# Altium schematic sheet TOP.SchDoc: =DocumentName
size 420 x 297 mm; Organization: Queen's Formula SAE; Address1: 130 Stuart St, Kingston; Address2: Ontario; Address3: Canada; Address4: K7L 2V9; DocumentNumber: 1; Revision: 0; SheetNumber: 1; SheetTotal: 1
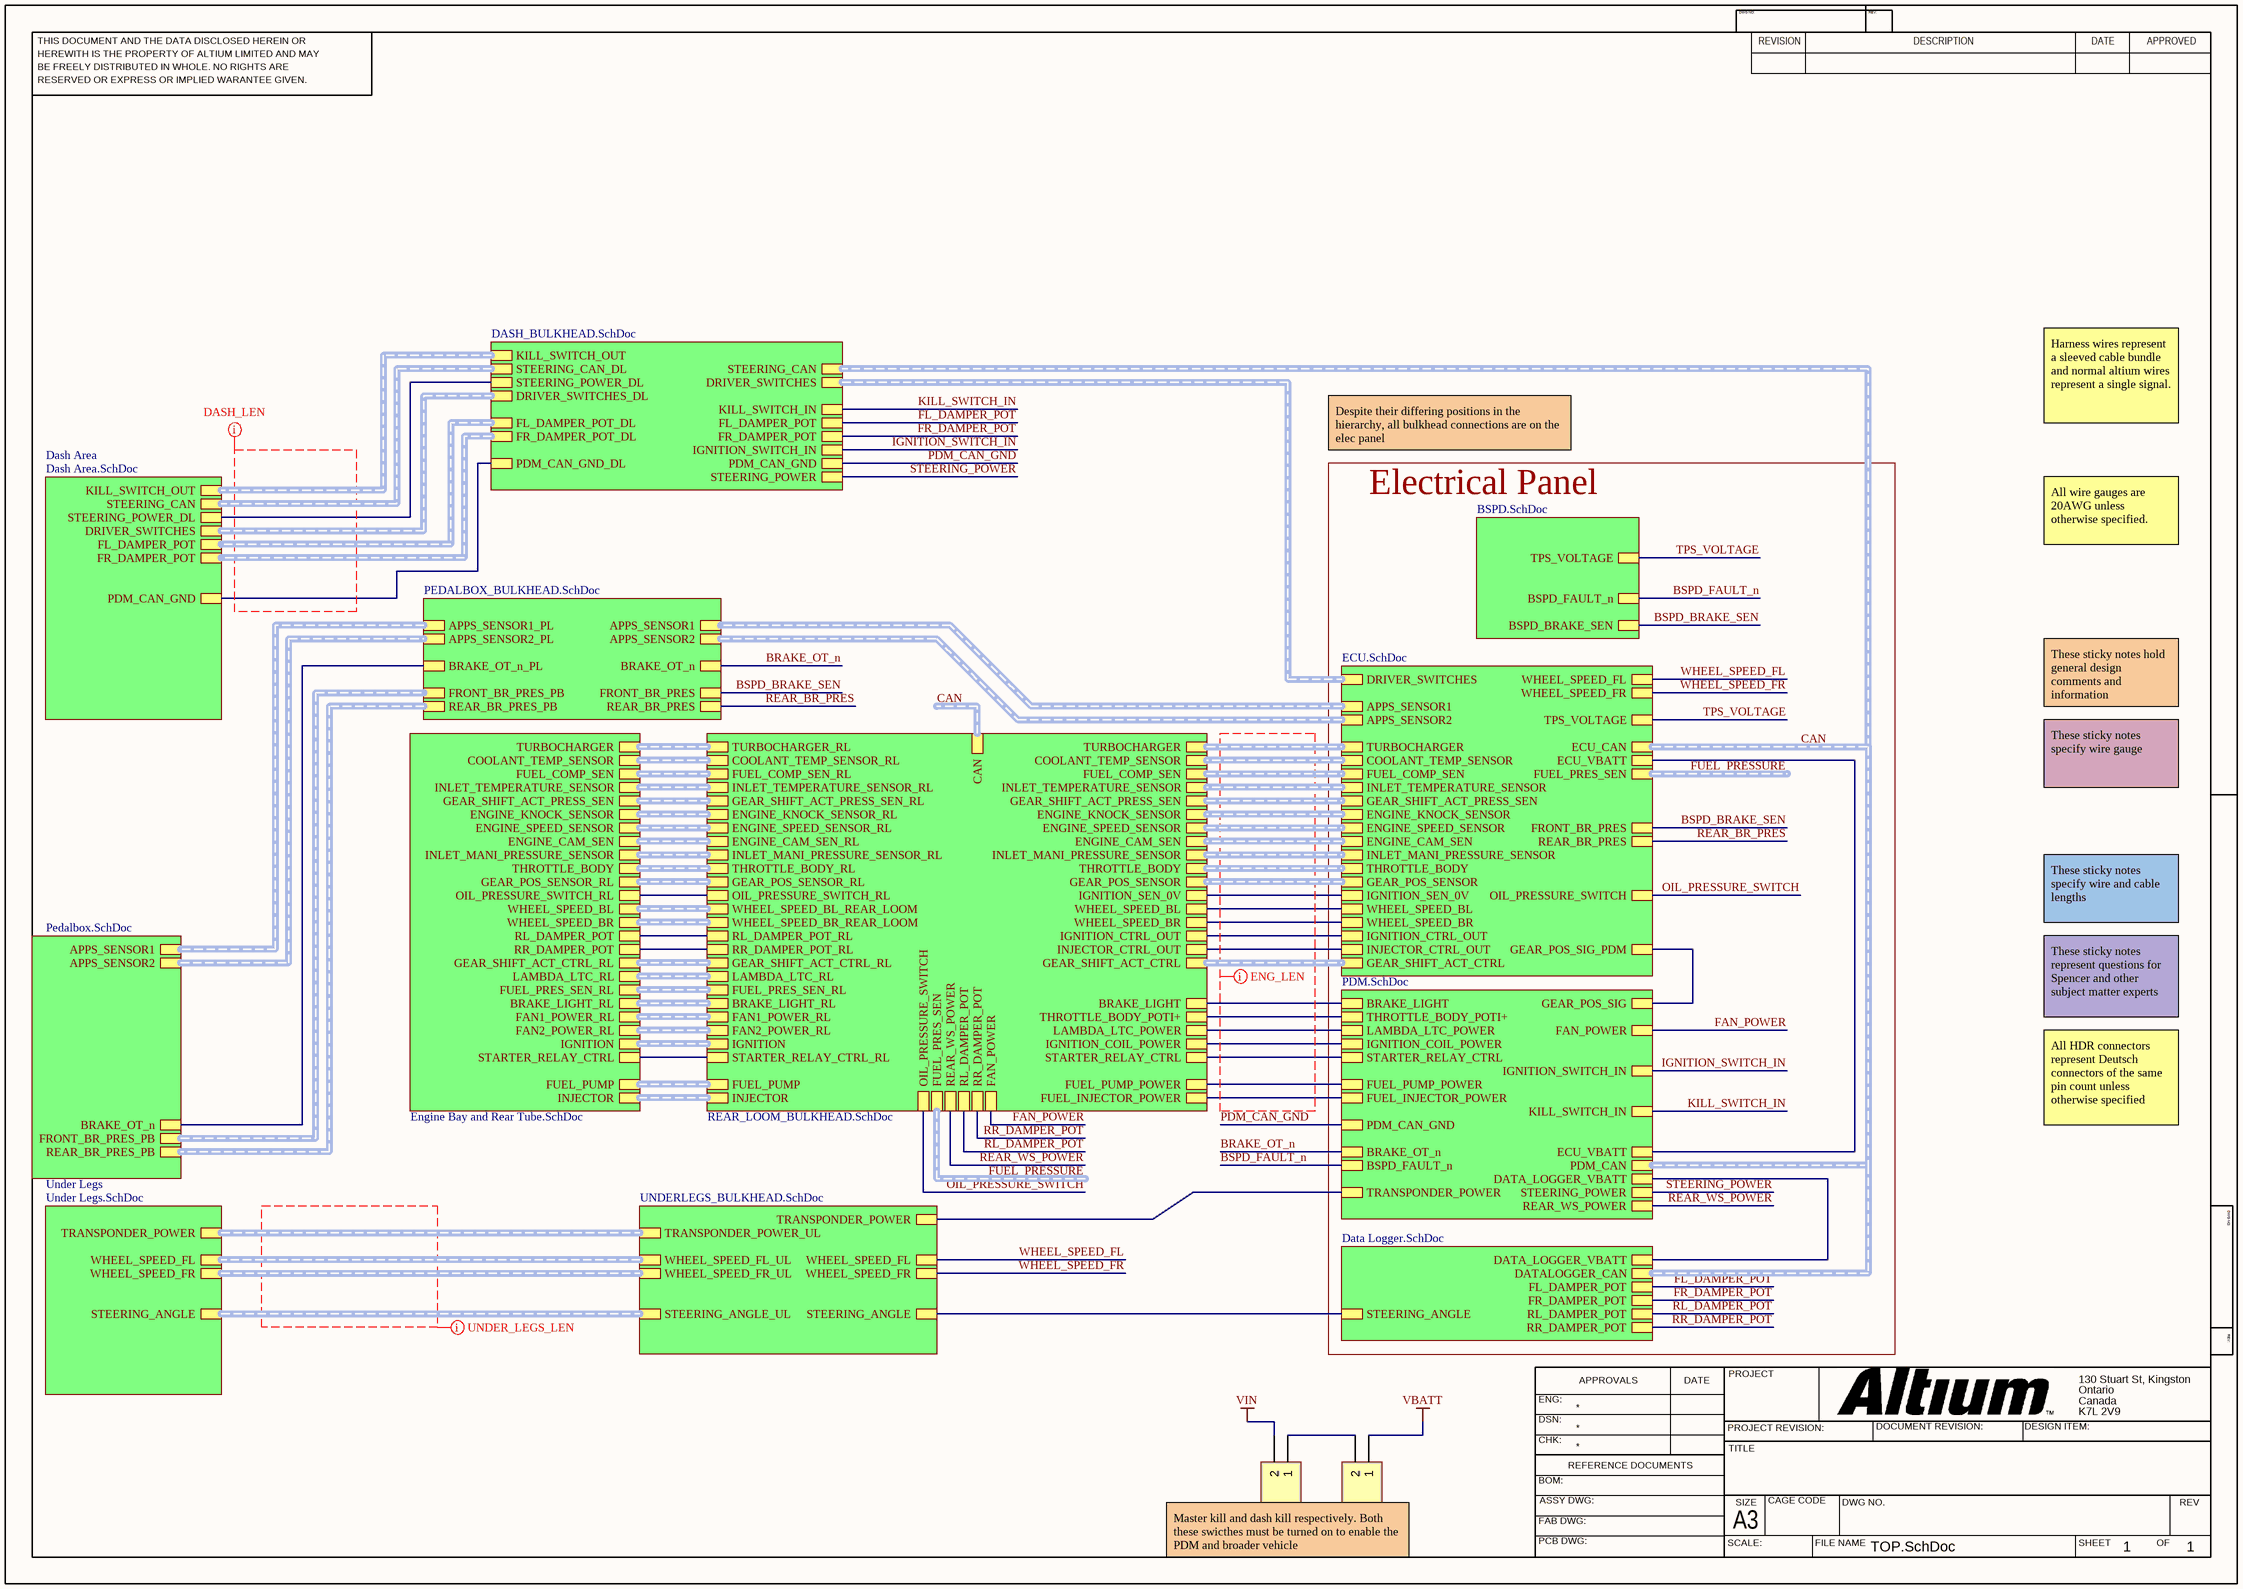
[diagram p0: TOP.SchDoc]

## Parts
(Parts that share a designator on the sheet are numbered #1, #2 ... from top to bottom, then left to right.)
ECU_CAN_CONNECTOR?#1  Header 2  [HDR1X2]  (value not drawn)
ECU_CAN_CONNECTOR?#2  Header 2  [HDR1X2]  (value not drawn)

## Sub-sheets
BSPD = BSPD.SchDoc: TPS_VOLTAGE, BSPD_BRAKE_SEN, BSPD_FAULT_n
Dash Area = Dash Area.SchDoc: STEERING_CAN (harness CAN), DRIVER_SWITCHES (harness DRIVER_SWITCHES), FL_DAMPER_POT, FR_DAMPER_POT, PDM_CAN_GND, STEERING_POWER_DL, KILL_SWITCH_OUT
DASH_BULKHEAD = DASH_BULKHEAD.SchDoc: DRIVER_SWITCHES (harness DRIVER_SWITCHES), STEERING_CAN (harness CAN), FL_DAMPER_POT, FR_DAMPER_POT, PDM_CAN_GND, DRIVER_SWITCHES_DL (harness DRIVER_SWITCHES), STEERING_CAN_DL (harness CAN), FL_DAMPER_POT_DL, FR_DAMPER_POT_DL, PDM_CAN_GND_DL, STEERING_POWER, STEERING_POWER_DL, KILL_SWITCH_IN, KILL_SWITCH_OUT, IGNITION_SWITCH_IN
Data Logger = Data Logger.SchDoc: DATALOGGER_CAN (harness CAN), DATA_LOGGER_VBATT, STEERING_ANGLE, RL_DAMPER_POT, RR_DAMPER_POT, FL_DAMPER_POT, FR_DAMPER_POT
ECU = ECU.SchDoc: ECU_CAN (harness CAN), ECU_VBATT, DRIVER_SWITCHES (harness DRIVER_SWITCHES), APPS_SENSOR1 (harness 3WIRE_PSG_SENSOR), COOLANT_TEMP_SENSOR (harness 2WIRE_SENSOR), INLET_TEMPERATURE_SENSOR (harness 2WIRE_SENSOR), FUEL_COMP_SEN (harness 2WIRE_SENSOR), GEAR_SHIFT_ACT_PRESS_SEN (harness 2WIRE_SENSOR), ENGINE_KNOCK_SENSOR (harness 2WIRE_ACTUATOR), ENGINE_SPEED_SENSOR (harness 2WIRE_ACTUATOR), WHEEL_SPEED_BL, WHEEL_SPEED_BR, WHEEL_SPEED_FL, WHEEL_SPEED_FR, ENGINE_CAM_SEN (harness 2WIRE_ACTUATOR), INLET_MANI_PRESSURE_SENSOR (harness 2WIRE_ACTUATOR), THROTTLE_BODY (harness 2WIRE_ACTUATOR), GEAR_SHIFT_ACT_CTRL (harness GEAR_SHIFT_ACTUATOR), TURBOCHARGER (harness TURBO), APPS_SENSOR2 (harness 3WIRE_PSG_SENSOR), IGNITION_CTRL_OUT, INJECTOR_CTRL_OUT, TPS_VOLTAGE, GEAR_POS_SENSOR (harness 2WIRE_ACTUATOR), IGNITION_SEN_0V, FUEL_PRES_SEN (harness 3WIRE_PSG_SENSOR), OIL_PRESSURE_SWITCH, FRONT_BR_PRES, REAR_BR_PRES, GEAR_POS_SIG_PDM
Engine Bay and Rear Tube = Engine Bay and Rear Tube.SchDoc: COOLANT_TEMP_SENSOR (harness 2WIRE_SENSOR), INLET_TEMPERATURE_SENSOR (harness 2WIRE_SENSOR), FUEL_COMP_SEN (harness 3WIRE_PSG_SENSOR), GEAR_SHIFT_ACT_PRESS_SEN (harness 3WIRE_PSG_SENSOR), ENGINE_KNOCK_SENSOR (harness 2WIRE_ACTUATOR), ENGINE_SPEED_SENSOR, ENGINE_CAM_SEN, INLET_MANI_PRESSURE_SENSOR, THROTTLE_BODY, WHEEL_SPEED_BL, WHEEL_SPEED_BR, GEAR_SHIFT_ACT_CTRL_RL, BRAKE_LIGHT_RL, IGNITION, STARTER_RELAY_CTRL, FUEL_PUMP, INJECTOR, TURBOCHARGER, RL_DAMPER_POT, RR_DAMPER_POT, GEAR_POS_SENSOR_RL, FAN1_POWER_RL, FAN2_POWER_RL, FUEL_PRES_SEN_RL, LAMBDA_LTC_RL, OIL_PRESSURE_SWITCH_RL
Engine Bay and Rear Tube = REAR_LOOM_BULKHEAD.SchDoc: BRAKE_LIGHT, WHEEL_SPEED_BL, WHEEL_SPEED_BR, THROTTLE_BODY_POTI+, IGNITION_COIL_POWER, STARTER_RELAY_CTRL, FUEL_PUMP_POWER, FUEL_INJECTOR_POWER, GEAR_SHIFT_ACT_CTRL, COOLANT_TEMP_SENSOR_RL (harness 2WIRE_SENSOR), INLET_TEMPERATURE_SENSOR_RL (harness 2WIRE_SENSOR), FUEL_COMP_SEN_RL (harness 3WIRE_PSG_SENSOR), GEAR_SHIFT_ACT_PRESS_SEN_RL (harness 3WIRE_PSG_SENSOR), ENGINE_KNOCK_SENSOR_RL (harness 2WIRE_ACTUATOR), ENGINE_SPEED_SENSOR_RL, ENGINE_CAM_SEN_RL, INLET_MANI_PRESSURE_SENSOR_RL, THROTTLE_BODY_RL, TURBOCHARGER_RL, COOLANT_TEMP_SENSOR (harness 2WIRE_SENSOR), INLET_TEMPERATURE_SENSOR (harness 2WIRE_SENSOR), FUEL_COMP_SEN (harness 3WIRE_PSG_SENSOR), GEAR_SHIFT_ACT_PRESS_SEN (harness 3WIRE_PSG_SENSOR), ENGINE_KNOCK_SENSOR (harness 2WIRE_ACTUATOR), ENGINE_SPEED_SENSOR, ENGINE_CAM_SEN, INLET_MANI_PRESSURE_SENSOR, THROTTLE_BODY, TURBOCHARGER, WHEEL_SPEED_BL_REAR_LOOM, WHEEL_SPEED_BR_REAR_LOOM, GEAR_SHIFT_ACT_CTRL_RL, BRAKE_LIGHT_RL, IGNITION_CTRL_OUT, INJECTOR_CTRL_OUT, IGNITION, INJECTOR, FUEL_PUMP, STARTER_RELAY_CTRL_RL, GEAR_POS_SENSOR, RL_DAMPER_POT_RL, RR_DAMPER_POT_RL, GEAR_POS_SENSOR_RL, RL_DAMPER_POT, RR_DAMPER_POT, REAR_WS_POWER, IGNITION_SEN_0V, FAN_POWER, FAN2_POWER_RL, FAN1_POWER_RL, FUEL_PRES_SEN_RL, FUEL_PRES_SEN, CAN, LAMBDA_LTC_POWER, LAMBDA_LTC_RL, OIL_PRESSURE_SWITCH, OIL_PRESSURE_SWITCH_RL
PDM = PDM.SchDoc: TRANSPONDER_POWER, BRAKE_LIGHT, BRAKE_OT_n, BSPD_FAULT_n, PDM_CAN_GND, PDM_CAN (harness CAN), DATA_LOGGER_VBATT, ECU_VBATT, KILL_SWITCH_IN, THROTTLE_BODY_POTI+, IGNITION_COIL_POWER, STARTER_RELAY_CTRL, FUEL_PUMP_POWER, FUEL_INJECTOR_POWER, FAN_POWER, STEERING_POWER, REAR_WS_POWER, LAMBDA_LTC_POWER, IGNITION_SWITCH_IN, GEAR_POS_SIG
Pedalbox = Pedalbox.SchDoc: APPS_SENSOR1 (harness 3WIRE_PSG_SENSOR), BRAKE_OT_n, APPS_SENSOR2, FRONT_BR_PRES_PB, REAR_BR_PRES_PB
PEDALBOX_BULKHEAD = PEDALBOX_BULKHEAD.SchDoc: APPS_SENSOR1 (harness 3WIRE_PSG_SENSOR), APPS_SENSOR2, BRAKE_OT_n, APPS_SENSOR1_PL (harness 3WIRE_PSG_SENSOR), APPS_SENSOR2_PL, BRAKE_OT_n_PL, REAR_BR_PRES, FRONT_BR_PRES, REAR_BR_PRES_PB, FRONT_BR_PRES_PB
Under Legs = Under Legs.SchDoc: STEERING_ANGLE, WHEEL_SPEED_FL, WHEEL_SPEED_FR, TRANSPONDER_POWER
UNDERLEGS_BULKHEAD = UNDERLEGS_BULKHEAD.SchDoc: STEERING_ANGLE, STEERING_ANGLE_UL, WHEEL_SPEED_FL, WHEEL_SPEED_FR, WHEEL_SPEED_FL_UL, WHEEL_SPEED_FR_UL, TRANSPONDER_POWER_UL, TRANSPONDER_POWER

## Nets
VBATT: ECU_CAN_CONNECTOR?#2.1
VIN: ECU_CAN_CONNECTOR?#1.2
BRAKE_OT_n: sheet PDM/BRAKE_OT_n, sheet PEDALBOX_BULKHEAD/BRAKE_OT_n
BSPD_BRAKE_SEN: sheet ECU/FRONT_BR_PRES, sheet PEDALBOX_BULKHEAD/FRONT_BR_PRES, sheet BSPD/BSPD_BRAKE_SEN
BSPD_FAULT_n: sheet PDM/BSPD_FAULT_n, sheet BSPD/BSPD_FAULT_n
FAN_POWER: sheet PDM/FAN_POWER, sheet Engine Bay and Rear Tube/FAN_POWER
FL_DAMPER_POT: sheet Data Logger/FL_DAMPER_POT, sheet DASH_BULKHEAD/FL_DAMPER_POT
FR_DAMPER_POT: sheet Data Logger/FR_DAMPER_POT, sheet DASH_BULKHEAD/FR_DAMPER_POT
IGNITION_SWITCH_IN: sheet PDM/IGNITION_SWITCH_IN, sheet DASH_BULKHEAD/IGNITION_SWITCH_IN
KILL_SWITCH_IN: sheet PDM/KILL_SWITCH_IN, sheet DASH_BULKHEAD/KILL_SWITCH_IN
OIL_PRESSURE_SWITCH: sheet ECU/OIL_PRESSURE_SWITCH, sheet Engine Bay and Rear Tube/OIL_PRESSURE_SWITCH
PDM_CAN_GND: sheet PDM/PDM_CAN_GND, sheet DASH_BULKHEAD/PDM_CAN_GND
REAR_BR_PRES: sheet ECU/REAR_BR_PRES, sheet PEDALBOX_BULKHEAD/REAR_BR_PRES
REAR_WS_POWER: sheet PDM/REAR_WS_POWER, sheet Engine Bay and Rear Tube/REAR_WS_POWER
RL_DAMPER_POT: sheet Data Logger/RL_DAMPER_POT, sheet Engine Bay and Rear Tube/RL_DAMPER_POT
RR_DAMPER_POT: sheet Data Logger/RR_DAMPER_POT, sheet Engine Bay and Rear Tube/RR_DAMPER_POT
STEERING_POWER: sheet PDM/STEERING_POWER, sheet DASH_BULKHEAD/STEERING_POWER
TPS_VOLTAGE: sheet ECU/TPS_VOLTAGE, sheet BSPD/TPS_VOLTAGE
WHEEL_SPEED_FL: sheet ECU/WHEEL_SPEED_FL, sheet UNDERLEGS_BULKHEAD/WHEEL_SPEED_FL
WHEEL_SPEED_FR: sheet ECU/WHEEL_SPEED_FR, sheet UNDERLEGS_BULKHEAD/WHEEL_SPEED_FR
NetECU_CAN_CONNECTOR?#1_1: ECU_CAN_CONNECTOR?#1.1 ECU_CAN_CONNECTOR?#2.2
(unnamed): sheet Dash Area/PDM_CAN_GND, sheet DASH_BULKHEAD/PDM_CAN_GND_DL
(unnamed): sheet Dash Area/STEERING_POWER_DL, sheet DASH_BULKHEAD/STEERING_POWER_DL
(unnamed): sheet Pedalbox/BRAKE_OT_n, sheet PEDALBOX_BULKHEAD/BRAKE_OT_n_PL
(unnamed): sheet ECU/ECU_VBATT, sheet PDM/ECU_VBATT
(unnamed): sheet ECU/WHEEL_SPEED_BL, sheet Engine Bay and Rear Tube/WHEEL_SPEED_BL
(unnamed): sheet ECU/WHEEL_SPEED_BR, sheet Engine Bay and Rear Tube/WHEEL_SPEED_BR
(unnamed): sheet ECU/IGNITION_CTRL_OUT, sheet Engine Bay and Rear Tube/IGNITION_CTRL_OUT
(unnamed): sheet ECU/INJECTOR_CTRL_OUT, sheet Engine Bay and Rear Tube/INJECTOR_CTRL_OUT
(unnamed): sheet ECU/IGNITION_SEN_0V, sheet Engine Bay and Rear Tube/IGNITION_SEN_0V
(unnamed): sheet ECU/GEAR_POS_SIG_PDM, sheet PDM/GEAR_POS_SIG
(unnamed): sheet Engine Bay and Rear Tube/STARTER_RELAY_CTRL, sheet Engine Bay and Rear Tube/STARTER_RELAY_CTRL_RL
(unnamed): sheet Engine Bay and Rear Tube/RL_DAMPER_POT, sheet Engine Bay and Rear Tube/RL_DAMPER_POT_RL
(unnamed): sheet Engine Bay and Rear Tube/RR_DAMPER_POT, sheet Engine Bay and Rear Tube/RR_DAMPER_POT_RL
(unnamed): sheet Engine Bay and Rear Tube/OIL_PRESSURE_SWITCH_RL, sheet Engine Bay and Rear Tube/OIL_PRESSURE_SWITCH_RL
(unnamed): sheet PDM/TRANSPONDER_POWER, sheet UNDERLEGS_BULKHEAD/TRANSPONDER_POWER
(unnamed): sheet PDM/BRAKE_LIGHT, sheet Engine Bay and Rear Tube/BRAKE_LIGHT
(unnamed): sheet PDM/DATA_LOGGER_VBATT, sheet Data Logger/DATA_LOGGER_VBATT
(unnamed): sheet PDM/THROTTLE_BODY_POTI+, sheet Engine Bay and Rear Tube/THROTTLE_BODY_POTI+
(unnamed): sheet PDM/IGNITION_COIL_POWER, sheet Engine Bay and Rear Tube/IGNITION_COIL_POWER
(unnamed): sheet PDM/STARTER_RELAY_CTRL, sheet Engine Bay and Rear Tube/STARTER_RELAY_CTRL
(unnamed): sheet PDM/FUEL_PUMP_POWER, sheet Engine Bay and Rear Tube/FUEL_PUMP_POWER
(unnamed): sheet PDM/FUEL_INJECTOR_POWER, sheet Engine Bay and Rear Tube/FUEL_INJECTOR_POWER
(unnamed): sheet PDM/LAMBDA_LTC_POWER, sheet Engine Bay and Rear Tube/LAMBDA_LTC_POWER
(unnamed): sheet Data Logger/STEERING_ANGLE, sheet UNDERLEGS_BULKHEAD/STEERING_ANGLE

## Buses and harness runs
harness CAN = sheet DASH_BULKHEAD/STEERING_CAN = sheet Data Logger/DATALOGGER_CAN = sheet ECU/ECU_CAN = sheet PDM/PDM_CAN
harness CAN = sheet Engine Bay and Rear Tube/CAN
harness FUEL_PRESSURE = sheet ECU/FUEL_PRES_SEN
harness FUEL_PRESSURE = sheet Engine Bay and Rear Tube/FUEL_PRES_SEN
harness sheet Dash Area/DRIVER_SWITCHES = sheet DASH_BULKHEAD/DRIVER_SWITCHES_DL
harness sheet Dash Area/FL_DAMPER_POT = sheet DASH_BULKHEAD/FL_DAMPER_POT_DL
harness sheet Dash Area/FR_DAMPER_POT = sheet DASH_BULKHEAD/FR_DAMPER_POT_DL
harness sheet Dash Area/KILL_SWITCH_OUT = sheet DASH_BULKHEAD/KILL_SWITCH_OUT
harness sheet Dash Area/STEERING_CAN = sheet DASH_BULKHEAD/STEERING_CAN_DL
harness sheet DASH_BULKHEAD/DRIVER_SWITCHES = sheet ECU/DRIVER_SWITCHES
harness sheet ECU/APPS_SENSOR1 = sheet PEDALBOX_BULKHEAD/APPS_SENSOR1
harness sheet ECU/APPS_SENSOR2 = sheet PEDALBOX_BULKHEAD/APPS_SENSOR2
harness sheet ECU/COOLANT_TEMP_SENSOR = sheet Engine Bay and Rear Tube/COOLANT_TEMP_SENSOR
harness sheet ECU/ENGINE_CAM_SEN = sheet Engine Bay and Rear Tube/ENGINE_CAM_SEN
harness sheet ECU/ENGINE_KNOCK_SENSOR = sheet Engine Bay and Rear Tube/ENGINE_KNOCK_SENSOR
harness sheet ECU/ENGINE_SPEED_SENSOR = sheet Engine Bay and Rear Tube/ENGINE_SPEED_SENSOR
harness sheet ECU/FUEL_COMP_SEN = sheet Engine Bay and Rear Tube/FUEL_COMP_SEN
harness sheet ECU/GEAR_POS_SENSOR = sheet Engine Bay and Rear Tube/GEAR_POS_SENSOR
harness sheet ECU/GEAR_SHIFT_ACT_CTRL = sheet Engine Bay and Rear Tube/GEAR_SHIFT_ACT_CTRL
harness sheet ECU/GEAR_SHIFT_ACT_PRESS_SEN = sheet Engine Bay and Rear Tube/GEAR_SHIFT_ACT_PRESS_SEN
harness sheet ECU/INLET_MANI_PRESSURE_SENSOR = sheet Engine Bay and Rear Tube/INLET_MANI_PRESSURE_SENSOR
harness sheet ECU/INLET_TEMPERATURE_SENSOR = sheet Engine Bay and Rear Tube/INLET_TEMPERATURE_SENSOR
harness sheet ECU/THROTTLE_BODY = sheet Engine Bay and Rear Tube/THROTTLE_BODY
harness sheet ECU/TURBOCHARGER = sheet Engine Bay and Rear Tube/TURBOCHARGER
harness sheet Engine Bay and Rear Tube/COOLANT_TEMP_SENSOR = sheet Engine Bay and Rear Tube/COOLANT_TEMP_SENSOR_RL
harness sheet Engine Bay and Rear Tube/ENGINE_CAM_SEN = sheet Engine Bay and Rear Tube/ENGINE_CAM_SEN_RL
harness sheet Engine Bay and Rear Tube/ENGINE_KNOCK_SENSOR = sheet Engine Bay and Rear Tube/ENGINE_KNOCK_SENSOR_RL
harness sheet Engine Bay and Rear Tube/ENGINE_SPEED_SENSOR = sheet Engine Bay and Rear Tube/ENGINE_SPEED_SENSOR_RL
harness sheet Engine Bay and Rear Tube/FUEL_COMP_SEN = sheet Engine Bay and Rear Tube/FUEL_COMP_SEN_RL
harness sheet Engine Bay and Rear Tube/GEAR_SHIFT_ACT_PRESS_SEN = sheet Engine Bay and Rear Tube/GEAR_SHIFT_ACT_PRESS_SEN_RL
harness sheet Engine Bay and Rear Tube/INLET_MANI_PRESSURE_SENSOR = sheet Engine Bay and Rear Tube/INLET_MANI_PRESSURE_SENSOR_RL
harness sheet Engine Bay and Rear Tube/INLET_TEMPERATURE_SENSOR = sheet Engine Bay and Rear Tube/INLET_TEMPERATURE_SENSOR_RL
harness sheet Engine Bay and Rear Tube/THROTTLE_BODY = sheet Engine Bay and Rear Tube/THROTTLE_BODY_RL
harness sheet Engine Bay and Rear Tube/TURBOCHARGER = sheet Engine Bay and Rear Tube/TURBOCHARGER_RL
harness sheet Engine Bay and Rear Tube/WHEEL_SPEED_BL = sheet Engine Bay and Rear Tube/WHEEL_SPEED_BL_REAR_LOOM
harness sheet Engine Bay and Rear Tube/WHEEL_SPEED_BR = sheet Engine Bay and Rear Tube/WHEEL_SPEED_BR_REAR_LOOM
harness sheet Pedalbox/APPS_SENSOR1 = sheet PEDALBOX_BULKHEAD/APPS_SENSOR1_PL
harness sheet Pedalbox/APPS_SENSOR2 = sheet PEDALBOX_BULKHEAD/APPS_SENSOR2_PL
harness sheet Pedalbox/FRONT_BR_PRES_PB = sheet PEDALBOX_BULKHEAD/FRONT_BR_PRES_PB
harness sheet Pedalbox/REAR_BR_PRES_PB = sheet PEDALBOX_BULKHEAD/REAR_BR_PRES_PB
harness sheet Under Legs/STEERING_ANGLE = sheet UNDERLEGS_BULKHEAD/STEERING_ANGLE_UL
harness sheet Under Legs/TRANSPONDER_POWER = sheet UNDERLEGS_BULKHEAD/TRANSPONDER_POWER_UL
harness sheet Under Legs/WHEEL_SPEED_FL = sheet UNDERLEGS_BULKHEAD/WHEEL_SPEED_FL_UL
harness sheet Under Legs/WHEEL_SPEED_FR = sheet UNDERLEGS_BULKHEAD/WHEEL_SPEED_FR_UL

## Layout directives
mark named UNDER_LEGS_LEN: (no net found under the mark)
mark named ENG_LEN: (no net found under the mark)
mark named DASH_LEN: (no net found under the mark)

## Notes on the sheet
- Despite their differing positions in the hierarchy, all bulkhead connections are on the elec panel
- Harness wires represent a sleeved cable bundle and normal altium wires represent a single signal.
- Electrical Panel
- All wire gauges are 20AWG unless otherwise specified.
- These sticky notes hold general design comments and information
- These sticky notes specify wire gauge
- These sticky notes specify wire and cable lengths
- These sticky notes represent questions for Spencer and other subject matter experts
- All HDR connectors represent Deutsch connectors of the same pin count unless otherwise specified
- (near ECU_CAN_CONNECTOR?#1) Master kill and dash kill respectively. Both these swicthes must be turned on to enable the PDM and broader vehicle
- THIS DOCUMENT AND THE DATA DISCLOSED HEREIN OR
- HEREWITH IS THE PROPERTY OF ALTIUM LIMITED AND MAY
- DWG NO:
- REVISION
- REV:
- DESCRIPTION
- DATE
- APPROVED
- BE FREELY DISTRIBUTED IN WHOLE. NO RIGHTS ARE
- RESERVED OR EXPRESS OR IMPLIED WARANTEE GIVEN.
- ENG:
- APPROVALS
- PROJECT
- DSN:
- CHK:
- REFERENCE DOCUMENTS
- PROJECT REVISION:
- TITLE
- DOCUMENT REVISION:
- DESIGN ITEM:
- BOM:
- FAB DWG:
- PCB DWG:
- ASSY DWG:
- SCALE:
- A3
- SIZE
- CAGE CODE
- FILE NAME
- DWG NO.
- SHEET
- OF
- REV

## Library data of the parts
ECU_CAN_CONNECTOR?#1 ECU_CAN_CONNECTOR?#2 = Header 2: Header, 2-Pin; LatestRevisionDate: 17-Jul-2002; LatestRevisionNote: Re-released for DXP Platform.; Publisher: Altium Limited